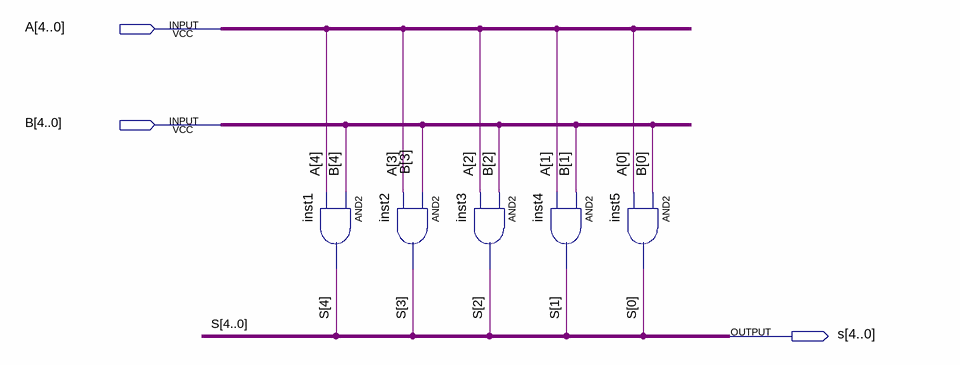
[diagram p0: schematic sheet]
// Quartus schematic And5bits.bdf as structural Verilog: 5 symbols, 3 pins
module And5bits (
  input  [4:0] A,
  input  [4:0] B,
  output [4:0] s
);

  and inst1 (s[4], B[4], A[4]);
  and inst2 (s[3], B[3], A[3]);
  and inst3 (s[2], B[2], A[2]);
  and inst4 (s[1], B[1], A[1]);
  and inst5 (s[0], B[0], A[0]);
endmodule
